# EAGLE design PunktSchweiss_ohne_NT2 (EAGLE 6.5.0)
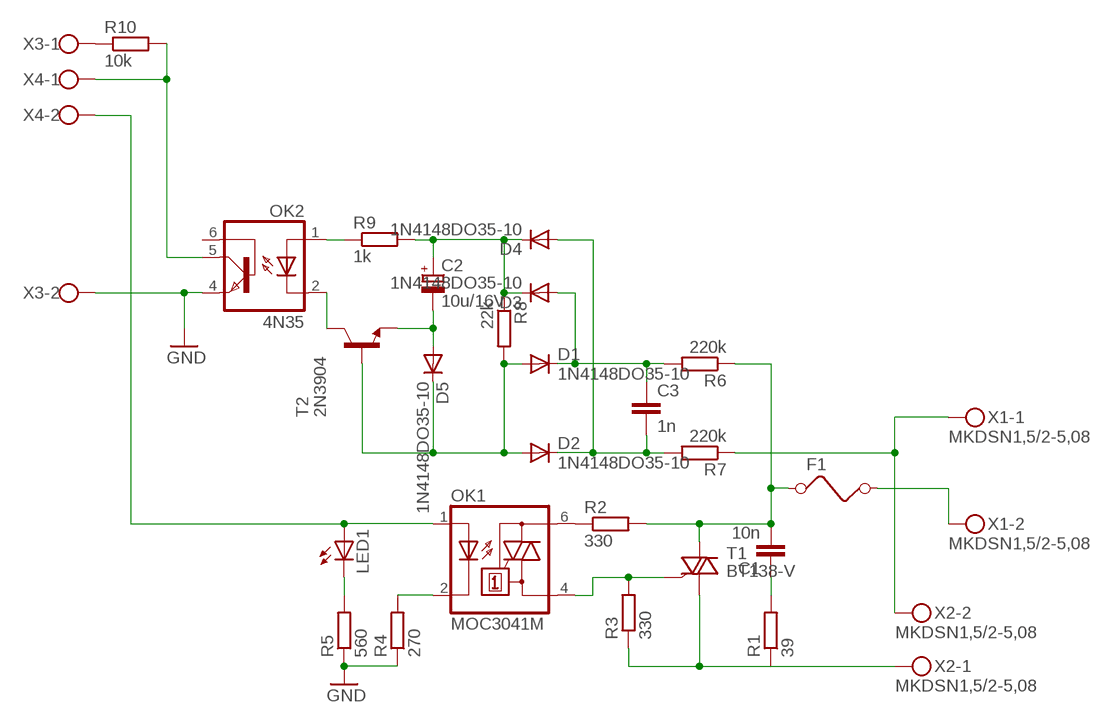
[diagram p0: schematic, sheet 1]

## Parts
C1  10n  C-EU102-043X133  [C102-043X133]
C2  10u/16V  CPOL-EUE1.8-4  [E1,8-4]
C3  1n  C-EU050-030X075  [C050-030X075]
D1  1N4148DO35-10  [DO35-10]
D2  1N4148DO35-10  [DO35-10]
D3  1N4148DO35-10  [DO35-10]
D4  1N4148DO35-10  [DO35-10]
D5  1N4148DO35-10  [DO35-10]
F1  FUSE  [FUSE]
LED1  LED3MM  [LED3MM]
OK1  MOC3041M  [DIL06]
OK2  4N35  [DIL06]
R1  39  R-EU_0207/10  [0207/10]
R2  330  R-EU_0207/10  [0207/10]
R3  330  R-EU_0207/10  [0207/10]
R4  270  R-EU_0207/10  [0207/10]
R5  560  R-EU_0207/10  [0207/10]
R6  220k  R-EU_0207/10  [0207/10]
R7  220k  R-EU_0207/10  [0207/10]
R8  22k  R-EU_0207/10  [0207/10]
R9  1k  R-EU_0207/10  [0207/10]
R10  10k  R-EU_0207/10  [0207/10]
T1  BT138-V  [TO220BV]
T2  2N3904  [TO92]
X1  MKDSN1,5/2-5,08  [MKDSN1,5/2-5,08]
X2  MKDSN1,5/2-5,08  [MKDSN1,5/2-5,08]
X3  W237-102  [W237-102]
X4  W237-102  [W237-102]

## Nets
D3: LED1.A OK1.1(A) X4.2
GND: OK2.4(EMI) R4.1 R5.1 X3.2
N$1: OK1.2(C) R4.2
N$2: LED1.K(C) R5.2
N$3: OK2.5(COL) R10.2 X4.1
N$4: R10.1 X3.1
N$5: C1.2 F1.1 R2.2 R6.1 T1.T2(A2)
N$6: OK1.4(A1) R3.2 T1.G
N$7: C1.1 R1.2
N$8: OK1.6(A2) R2.1
N$10: C2.+ D3.C D4.C R8.1 R9.2
N$11: R1.1 R3.1 T1.T1(A1) X2.1
N$12: R7.1 X1.1 X2.2
N$13: F1.2 X1.2
N$14: D1.A D2.A D5.C R8.2 T2.2(B)
N$15: C3.1 D1.C D3.A R6.2
N$16: C3.2 D2.C D4.A R7.2
N$17: C2.- D5.A T2.3(E)
N$20: OK2.1(A) R9.1
N$21: OK2.2(C) T2.1(C)
Unconnected: OK2.6(BAS)

## Library data of the parts
C1 C3 = rcl:C-EU: CAPACITOR, European symbol
C2 = rcl:CPOL-EU: POLARIZED CAPACITOR, European symbol
D1-D5 = diode:1N4148: DIODE high speed (Philips)
F1 = special:FUSE: FUSE 5 x 20 mm
LED1 = led:LED: LED OSRAM: - CHIPLED LG R971, LG N971, LY N971, LG Q971, LY Q971, LO R971, LY R971 LH N974, LH R974 LS Q976, LO Q976, LY Q976 LO Q996 - Hyper CHIPLED LW Q18S LB Q993, LB Q99A, LB R99A - SideLED LS A670, LO A670, LY A670, LG A670, LP A670 LB A673, LV A673, LT A673, LW A673 LH A674 LY A675 LS A676, LA A676, LO A676, LY A676, LW A676 LS A679, LY A679, LG A679 - Hyper Micro SIDELED® LS Y876, LA Y876, LO Y876, LY Y876 LT Y87S - SmartLED LW L88C, LW L88S LB L89C, LB L89S, LG L890 LS L89K, LO L89K, LY L89K LS L896, LA L896, LO L896, LY L896 - TOPLED LS T670, LO T670, LY T670, LG T670, LP T670 LSG T670, LSP T670, LSY T670, LOP T670, LYG T670 LG T671, LOG T671, LSG T671 LB T673, LV T673, LT T673, LW T673 LH T674 LS T676, LA T676, LO T676, LY T676, LB T676, LH T676, LSB T676, LW T676 LB T67C, LV T67C, LT T67C, LS T67K, LO T67K, LY T67K, LW E67C LS E67B, LA E67B, LO E67B, LY E67B, LB E67C, LV E67C, LT E67C LW T67C LS T679, LY T679, LG T679 LS T770, LO T770, LY T770, LG T770, LP T770 LB T773, LV T773, LT T773, LW T773 LH T774 LS E675, LA E675, LY E675, LS T675 LS T776, LA T776, LO T776, LY T776, LB T776 LHGB T686 LT T68C, LB T68C - Hyper Mini TOPLED® LB M676 - Mini TOPLED Santana® LG M470 LS M47K, LO M47K, LY M47K Source: http://www.osram.convergy.de LUXEON: - LUMILED® LXK2-PW12-R00, LXK2-PW12-S00, LXK2-PW14-U00, LXK2-PW14-V00 LXK2-PM12-R00, LXK2-PM12-S00, LXK2-PM14-U00 LXK2-PE12-Q00, LXK2-PE12-R00, LXK2-PE12-S00, LXK2-PE14-T00, LXK2-PE14-U00 LXK2-PB12-K00, LXK2-PB12-L00, LXK2-PB12-M00, LXK2-PB14-N00, LXK2-PB14-P00, LXK2-PB14-Q00 LXK2-PR12-L00, LXK2-PR12-M00, LXK2-PR14-Q00, LXK2-PR14-R00 LXK2-PD12-Q00, LXK2-PD12-R00, LXK2-PD12-S00 LXK2-PH12-R00, LXK2-PH12-S00 LXK2-PL12-P00, LXK2-PL12-Q00, LXK2-PL12-R00 Source: www.luxeon.com KINGBRIGHT: KA-3528ASYC Source: www.kingbright.com
OK1 = optocoupler:MOC30*: 6-Pin DIP Zero-Cross Optoisolators Triac Driver Output (250/400 Volt Peak) Source: Data sheet <http://www.fairchildsemi.com/ds/MO/MOC3031M.pdf> The old path of data sheet not more available 2013-05-06.; MF: FAIRCHILD SEMICONDUCTOR; MPN: MOC3041M; OC_FARNELL: 1086677; OC_NEWARK: 78K6090
OK2 = optocoupler:4N35: MOTOROLA OPTO COUPLER; MF: FAIRCHILD SEMICONDUCTOR; MPN: 4N35; OC_FARNELL: 1328375; OC_NEWARK: 72K9946
R1-R10 = rcl:R-EU_: RESISTOR, European symbol
T1 = triac:BT138: TRIAC Source: http://www.semiconductors.philips.com BT138_SERIES_2.pdf
T2 = transistor:2N3904: NPN TRANSISTOR
X1 X2 = con-phoenix-508:MKDSN1,5/2-5,08: MKDSN 1,5/ 2-5,08 Printklemme Nennstrom: 13,5 A Nennspannung: 250 V Rastermaß: 5,08 mm Polzahl: 2 Anschlussart: Schraubanschluss Montage: Löten Anschlussrichtung Leiter/Platine: 0 ° Artikelnummer: 1729128 Source: http://eshop.phoenixcontact.com .. 1729128.pdf; MPN: MKDSN 1,5/2-5.08; OC_FARNELL: 1792903; OC_NEWARK: 30M2397
X3 X4 = con-wago-500:W237-102: WAGO SCREW CLAMP; MPN: 237-102; OC_FARNELL: unknown; OC_NEWARK: 70K9898

## Board
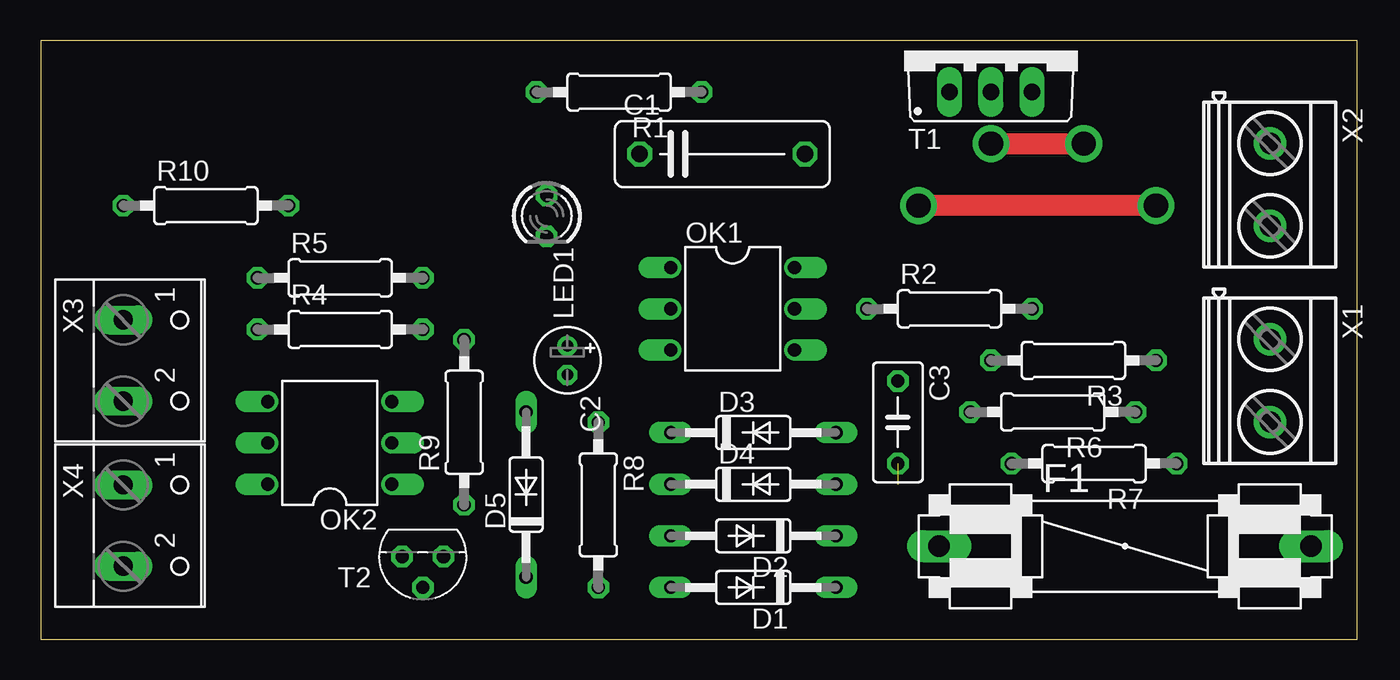
[diagram p1: board, top side]
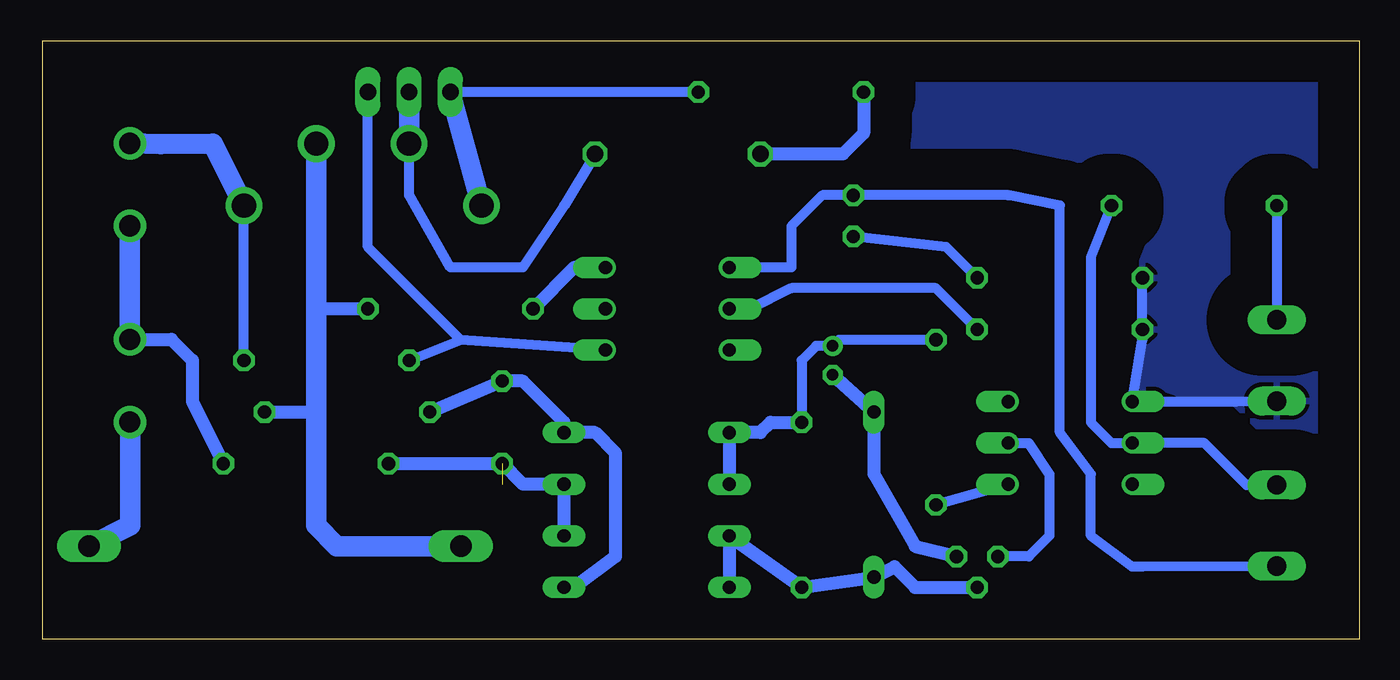
[diagram p2: board, bottom side, seen from below]

Size 80.95 x 36.82 mm. Coordinates in mm from the lower left corner, seen from the top.
Outline: 0,0 80.95,0 80.95,36.82 0,36.82 0,0
Copper layers (1*16): Top 0.035mm / dielectric 1.5mm / Bottom 0.035mm
Design rules "default": minimum track width 10mil, minimum drill 24mil, track to track 8mil, track to pad 8mil, pad to pad 8mil, via to via 8mil, smd to smd 8mil, copper to edge 40mil, drill to drill 8mil, minimum pad ring 10mil, minimum via ring 8mil, stop-mask expansion 4mil, vias tented up to drill 0mil, thermal gap 10mil

### Footprints (pad centres in the part's own frame; a part is rotated, then mirrored left to right if it is on the bottom)
C102-043X133 = drill 1.016 octagon: 1 -5.08,0; 2 5.08,0
E1,8-4 = drill 0.711 pad 1.168: + -0.889,0 | drill 0.711 pad 1.168 octagon: - 0.889,0
C050-030X075 = drill 0.813 octagon: 1 -2.54,0; 2 2.54,0
DO35-10 = drill 0.813 long: A 5.08,0; C -5.08,0
FUSE = drill 1.321 long: 1 -11.43,0; 2 11.43,0
LED3MM = drill 0.813 octagon: A -1.27,0; K 1.27,0
DIL06 = drill 0.813 offset: 1 -2.54,-3.81; 2 0,-3.81; 3 2.54,-3.81; 4 2.54,3.81; 5 0,3.81; 6 -2.54,3.81
0207/10 = drill 0.813 octagon: 1 -5.08,0; 2 5.08,0
TO220BV = drill 1.016 long: G 2.54,-2.54; T1 -2.54,-2.54; T2 0,-2.54
TO92 = drill 0.813 octagon: 1 1.27,0; 2 0,1.905; 3 -1.27,0
MKDSN1,5/2-5,08 = drill 1.3 pad 2: 1 -2.561,0.025; 2 2.519,0.025
W237-102 = drill 1.194 long: 1 -2.5,-1.27; 2 2.5,-1.27

### Placement (x,y rotation side)
C1  41.91,29.85 0 top
C2  32.39,17.14 270 top
C3  52.7,13.34 270 top
D1  43.81,3.18 180 top
D2  43.81,6.35 180 top
D3  43.81,12.7 0 top
D4  43.81,9.53 0 top
D5  29.85,8.89 90 top
F1  66.67,5.71 0 top
LED1  31.11,26.04 270 top
OK1  42.55,20.32 270 top
OK2  17.78,12.07 90 top
R1  35.56,33.66 180 top
R2  55.88,20.32 0 top
R3  63.5,17.14 180 top
R4  18.42,19.05 0 top
R5  18.42,22.23 0 top
R6  62.23,13.97 180 top
R7  64.77,10.8 180 top
R8  34.29,8.26 270 top
R9  26.04,13.34 90 top
R10  10.16,26.67 0 top
T1  58.42,36.19 0 top
T2  23.5,5.08 180 top
X1  75.56,15.88 270 top
X2  75.56,27.94 270 top
X3  6.35,17.14 270 top
X4  6.35,6.98 270 top

### Tracks (layer width: path | path; a pad name or v marks a point on that pad's centre or on a via)
D3
  Bottom 0.61: OK1.1 34.92,22.86 34.92,25.4 33.02,27.31 LED1.A 21.59,27.31 18.42,26.67 18.42,12.7 16.51,10.16 16.51,6.35 13.97,4.45 13.34,4.45 X4.2
GND
  Bottom 0.61: R5.1 R4.1 13.34,18.41 OK2.4 7.58,14.61 X3.2
  pour Bottom (isolate 2.54): 1.27,36.19 78.74,36.83 78.74,1.27 1.27,0.63
N$1
  Bottom 0.61: R4.2 26.04,21.59 34.92,21.59 37.47,20.32 OK1.2
N$2
  Bottom 0.61: R5.2 25.4,24.13 LED1.K
N$3
  Bottom 0.61: X4.1 6.95,9.48 9.53,12.07 OK2.5 15.24,12.07 16.51,13.34 16.51,23.5 R10.2
N$4
  Bottom 0.61: R10.1 X3.1
N$5  (via drill 1.5)
  Top 1.3: v58.42,30.48 v64.13,30.48
  Bottom 0.61: C1.2 48.89,26.67 51.44,22.86 55.88,22.86 58.42,27.31 v58.42,30.48
  Bottom 0.813: R6.1 64.13,13.97 | R2.2 64.13,20.32
  Bottom 1.27: F1.1 62.86,5.71 64.13,6.98 64.13,13.97 64.13,20.32 v64.13,30.48 | T1.T2 v58.42,30.48
N$6
  Bottom 0.61: 55.25,18.41 60.96,24.13 T1.G | OK1.4 55.25,18.41 | R3.2 55.25,18.41
N$7
  Bottom 0.813: R1.2 30.48,31.11 31.75,29.85 C1.1
N$8
  Bottom 0.813: OK1.6 48.26,22.86 R2.1
N$10
  Bottom 0.61: R9.2 32,18.41 C2.+ 33.4,18.03 34.29,17.14 R8.1
  Bottom 0.813: R8.1 36.2,13.34 36.83,12.7 D3.C D4.C
N$11  (via drill 0.6, 1.5)
  Top 1.3: v68.58,26.67 v53.97,26.67
  Bottom 0.61: R3.1 v68.58,26.67 | R1.1 T1.T1
  Bottom 1.27: X2.1 73.69,30.46 70.48,30.48 v68.58,26.67 | v53.97,26.67 T1.T1
N$12
  Bottom 0.813: X1.1 73.05,18.44 71.75,17.14 71.75,14.61 R7.1
  Bottom 1.27: X1.1 X2.2
N$13
  Bottom 0.406: 75.56,13.33 X1.2
  Bottom 1.27: F1.2 75.56,6.98 75.56,13.33
N$14
  Bottom 0.813: T2.2 27.31,3.18 28.57,4.45 D5.C R8.2 D2.A D1.A
N$15
  Bottom 0.813: R6.2 C3.1 51.44,15.88 48.89,13.34 D3.A 46.99,12.7 45.72,11.43 45.72,5.08 48.26,3.18 D1.C
N$16  (1 unrouted)
  Bottom 0.813: R7.2 C3.2 51.44,9.53 D4.A D2.C
N$17
  Bottom 0.813: C2.- D5.A 29.85,10.16 27.31,5.71 T2.3
N$20
  Bottom 0.61: OK2.1 R9.1
N$21
  Bottom 0.61: OK2.2 20.32,12.07 19.05,10.16 19.05,6.35 20.32,5.08 T2.1